# Altium schematic sheet WIFI控制平台.SchDoc
size A4
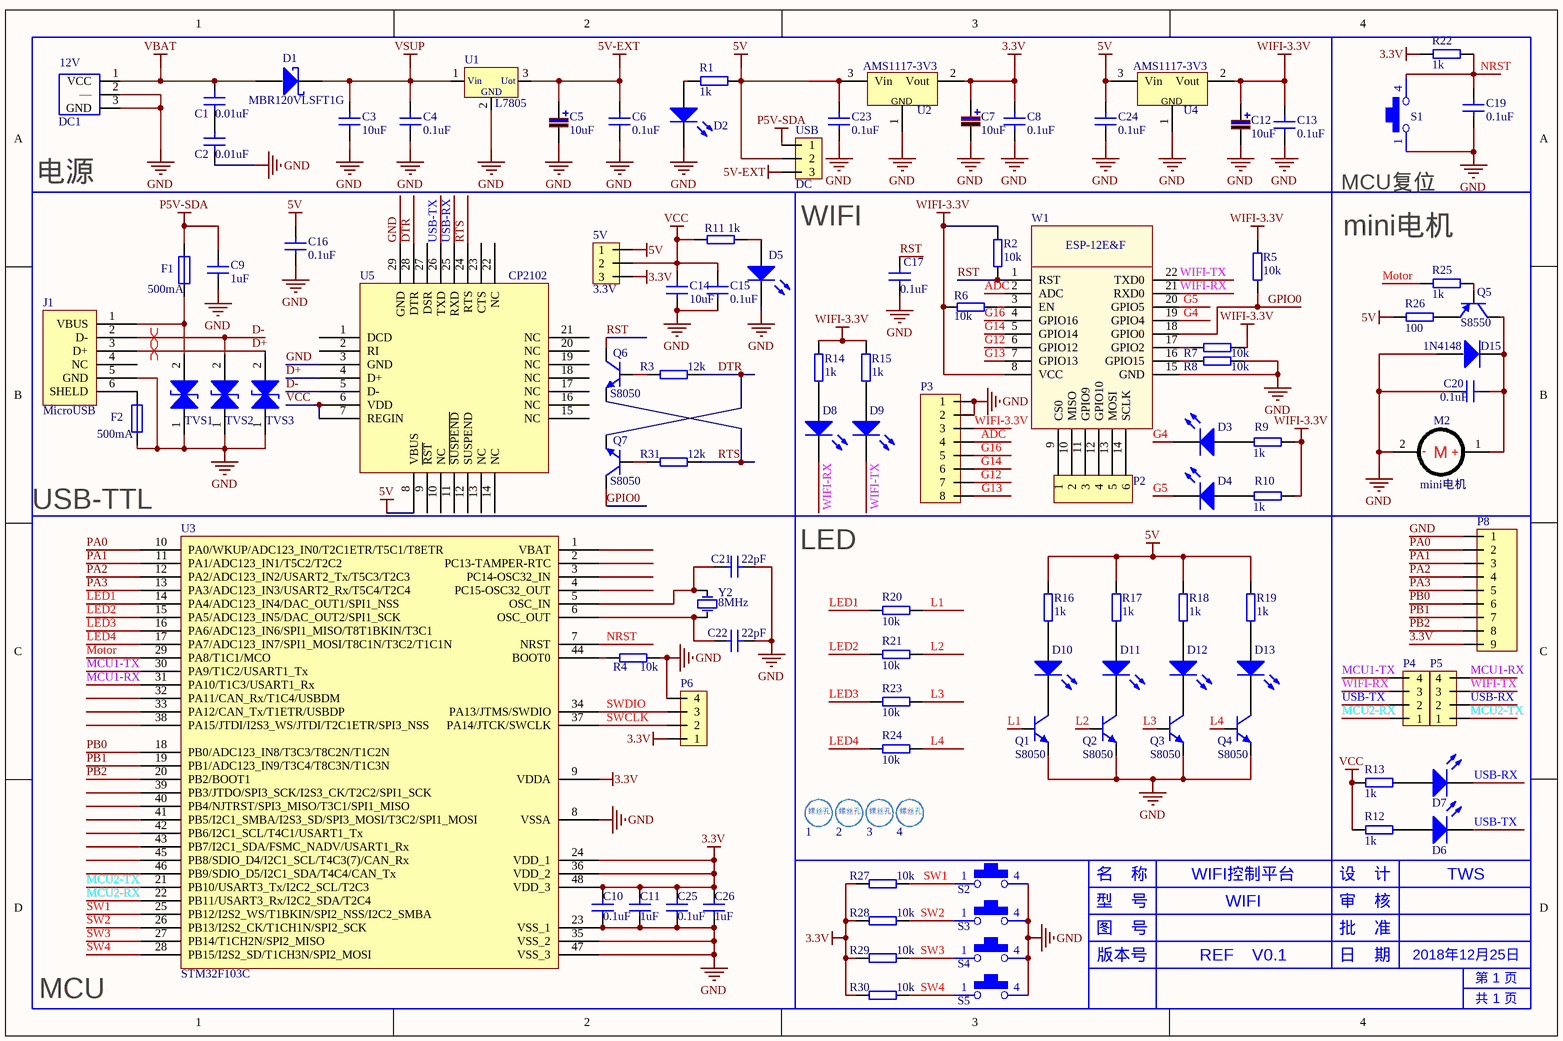
[diagram p0: WIFI控制平台.SchDoc]

## Parts
1  螺丝孔  [3.2mm螺丝孔]  (value not drawn)
2  螺丝孔  [3.2mm螺丝孔]  (value not drawn)
3  螺丝孔  [3.2mm螺丝孔]  (value not drawn)
4  螺丝孔  [3.2mm螺丝孔]  (value not drawn)
5V  3.3V  [HDR2.54-1X3]
C1  0.01uF  [C0805]
C2  0.01uF  [C0805]
C3  10uF  [C1210]
C4  0.1uF  [C0805]
C5  10uF  [C1206-p]
C6  0.1uF  [C0805]
C7  10uF  [C1206-p]
C8  0.1uF  [C0805]
C9  1uF  [C0603]
C10  0.1uF  [C0603]
C11  1uF  [C0603]
C12  10uF  [C1206-p]
C13  0.1uF  [C0805]
C14  10uF  [C0805]
C15  0.1uF  [C0603]
C16  0.1uF  [C0603]
C17  0.1uF  [C0603]
C19  0.1uF  [C0603]
C20  0.1uF  [C0805]
C21  22pF  [C0603]
C22  22pF  [C0603]
C23  0.1uF  [C0805]
C24  0.1uF  [C0805]
C25  0.1uF  [C0603]
C26  1uF  [C0603]
D1  MBR120VLSFT1G  [D-SMA]
D2  LED 红  [L0805]  (value not drawn)
D3  LED 红  [L0805]  (value not drawn)
D4  LED 红  [L0805]  (value not drawn)
D5  LED 红  [L0805]  (value not drawn)
D6  LED 红  [L0805]  (value not drawn)
D7  LED 红  [L0805]  (value not drawn)
D8  LED 红  [L0805]  (value not drawn)
D9  LED 红  [L0805]  (value not drawn)
D10  3528  [LED_3528]  (value not drawn)
D11  3528  [LED_3528]  (value not drawn)
D12  3528  [LED_3528]  (value not drawn)
D13  3528  [LED_3528]  (value not drawn)
D15  1N4148  [D0805]
DC1  12V  [DC-1]
F1  500mA  [R0805]
F2  500mA  [R0805]
J1  MicroUSB  [USB-Micro-牛角]
M2  mini电机  [mini电机]
P2  Header_1x6  [HDR2.54-1X6]  (value not drawn)
P3  Header_1x8  [HDR2.54-1X8]  (value not drawn)
P4  Header4  [HDR2.54-1X4]  (value not drawn)
P5  Header4  [HDR2.54-1X4]  (value not drawn)
P6  Header4  [HDR2.54-1X4-RowSeat]  (value not drawn)
P8  Header_1x9  [HDR2.54-1X9]  (value not drawn)
Q1  S8050  [SOT-23]
Q2  S8050  [SOT-23]
Q3  S8050  [SOT-23]
Q4  S8050  [SOT-23]
Q5  S8550  [SOT-23]
Q6  S8050  [SOT-23]
Q7  S8050  [SOT-23]
R1  1k  [R0603]
R2  10k  [R0603]
R3  12k  [R0603]
R4  10k  [R0603]
R5  10k  [R0603]
R6  10k  [R0603]
R7  10k  [R0603]
R8  10k  [R0603]
R9  1k  [R0603]
R10  1k  [R0603]
R11  1k  [R0603]
R12  1k  [R0603]
R13  1k  [R0603]
R14  1k  [R0603]
R15  1k  [R0603]
R16  1k  [R0805]
R17  1k  [R0805]
R18  1k  [R0805]
R19  1k  [R0805]
R20  10k  [R0603]
R21  10k  [R0603]
R22  1k  [R0603]
R23  10k  [R0603]
R24  10k  [R0603]
R25  1k  [R0603]
R26  100  [R0805]
R27  10k  [R0603]
R28  10k  [R0603]
R29  10k  [R0603]
R30  10k  [R0603]
R31  12k  [R0603]
S1  BUTTON  [Button-SW-SMD1]  (value not drawn)
S2  BUTTON  [Button-SW-SMD1]  (value not drawn)
S3  BUTTON  [Button-SW-SMD1]  (value not drawn)
S4  BUTTON  [Button-SW-SMD1]  (value not drawn)
S5  BUTTON  [Button-SW-SMD1]  (value not drawn)
TVS1  PESD5V0S1BA  [D-SOD-323]  (value not drawn)
TVS2  PESD5V0S1BA  [D-SOD-323]  (value not drawn)
TVS3  PESD5V0S1BA  [D-SOD-323]  (value not drawn)
U1  L7805  [TO252-3]
U2  AMS1117-3V3  [SOT-233]
U3  STM32F103C  [LQFP7x7-48]
U4  AMS1117-3V3  [SOT-233]
U5  CP2102  [QFN28]
USB  DC  [HDR2.54-1X3]
W1  ESP-12E&F  [ESP-12E&F Module]
Y2  value 8MHz  [X-SM49]  (hidden comment: XTAL)

## Nets
3.3V: 5V.3 C7.1 C8.2 C10.2 C11.2 C25.2 C26.2 P6.1 P8.9 R22.2 R27.1 R28.1 R29.1 R30.1 U2.2(Vout) U3.9(VDDA) U3.24(VDD_1) U3.36(VDD_2) U3.48(VDD_3)
5V: 5V.1 C16.2 C23.2 C24.2 R1.1 R16.2 R17.2 R18.2 R19.2 R26.1 U2.3(Vin) U4.3(Vin) U5.8(VBUS) USB.2
5V-EXT: C5.1 C6.2 U1.3 USB.3
GND: C2.1 C3.1 C4.1 C5.2 C6.1 C7.2 C8.1 C9.1 C10.1 C11.1 C12.2 C13.1 C14.1 C15.1 C16.1 C17.1 C19.1 C20.1 C21.2 C22.2 C23.1 C24.1 C25.1 C26.1 D2.2(K) D5.2(K) D15.1(A) DC1.2(—) DC1.3(GND) F2.2 J1.5(GND) M2.2(M-) P3.1 P3.2 P6.4 P8.1 Q1.2(E) Q2.2(E) Q3.2(E) Q4.2(E) R4.2 R8.2 S1.1 S2.4 S3.4 S4.4 S5.4 TVS1.1(A) TVS2.1(A) TVS3.1(A) U1.2 U2.1(GND) U3.8(VSSA) U3.23(VSS_1) U3.35(VSS_2) U3.47(VSS_3) U4.1(GND) U5.3(GND) U5.29(GND) W1.15(GND)
P5V-SDA: C9.2 F1.1 USB.1
VBAT: C1.2 D1.1(A) DC1.1(VCC)
VCC: 5V.2 C14.2 C15.2 R11.1 R12.2 R13.2 U5.6(VDD) U5.7(REGIN)
VSUP: C3.2 C4.2 D1.2(K) U1.1
WIFI-3.3V: C12.1 C13.2 P3.3 R2.2 R5.2 R6.1 R7.2 R9.1 R10.1 R14.2 R15.2 U4.2(Vout) W1.8(VCC)
ADC: P3.4 W1.2(ADC)
D+: J1.3(D+) TVS3.2 U5.4(D+)
D-: J1.2(D-) TVS2.2 U5.5(D-)
DTR: Q7.2(E) R3.2 U5.28(DTR)
G4: D3.2(K) W1.19(GPIO4)
G5: D4.2(K) W1.20(GPIO5)
G12: P3.7 W1.6(GPIO12)
G13: P3.8 W1.7(GPIO13)
G14: P3.6 W1.5(GPIO14)
G16: P3.5 W1.4(GPIO16)
GPIO0: Q7.3(C) R5.1 W1.18(GPIO0)
L1: Q1.1(B) R20.2
L2: Q2.1(B) R21.2
L3: Q3.1(B) R23.2
L4: Q4.1(B) R24.2
LED1: R20.1 U3.14(PA4/ADC123_IN4/DAC_OUT1/SPI1_NSS)
LED2: R21.1 U3.15(PA5/ADC123_IN5/DAC_OUT2/SPI1_SCK)
LED3: R23.1 U3.16(PA6/ADC123_IN6/SPI1_MISO/T8T1BKIN/T3C1)
LED4: R24.1 U3.17(PA7/ADC123_IN7/SPI1_MOSI/T8C1N/T3C2/T1C1N)
MCU1-RX: P5.4 U3.31(PA10/T1C3/USART1_Rx)
MCU1-TX: P4.4 U3.30(PA9/T1C2/USART1_Tx)
MCU2-RX: P4.1 U3.22(PB11/USART3_Rx/I2C2_SDA/T2C4)
MCU2-TX: P5.1 U3.21(PB10/USART3_Tx/I2C2_SCL/T2C3)
Motor: R25.2 U3.29(PA8/T1C1/MCO)
NRST: C19.2 R22.1 S1.4 U3.7(NRST)
PA0: P8.2 U3.10(PA0/WKUP/ADC123_IN0/T2C1ETR/T5C1/T8ETR)
PA1: P8.3 U3.11(PA1/ADC123_IN1/T5C2/T2C2)
PA2: P8.4 U3.12(PA2/ADC123_IN2/USART2_Tx/T5C3/T2C3)
PA3: P8.5 U3.13(PA3/ADC123_IN3/USART2_Rx/T5C4/T2C4)
PB0: P8.6 U3.18(PB0/ADC123_IN8/T3C3/T8C2N/T1C2N)
PB1: P8.7 U3.19(PB1/ADC123_IN9/T3C4/T8C3N/T1C3N)
PB2: P8.8 U3.20(PB2/BOOT1)
RST: C17.2 Q6.3(C) R2.1 W1.1(RST)
RTS: Q6.2(E) R31.2 U5.24(RTS)
SW1: R27.2 S2.1 U3.25(PB12/I2S2_WS/T1BKIN/SPI2_NSS/I2C2_SMBA)
SW2: R28.2 S3.1 U3.26(PB13/I2S2_CK/T1CH1N/SPI2_SCK)
SW3: R29.2 S4.1 U3.27(PB14/T1CH2N/SPI2_MISO)
SW4: R30.2 S5.1 U3.28(PB15/I2S2_SD/T1CH3N/SPI2_MOSI)
SWCLK: P6.2 U3.37(PA14/JTCK/SWCLK)
SWDIO: P6.3 U3.34(PA13/JTMS/SWDIO)
USB-RX: D7.2(K) P5.2 U5.25(RXD)
USB-TX: D6.2(K) P4.2 U5.26(TXD)
WIFI-RX: D8.2(K) P4.3 W1.21(RXD0)
WIFI-TX: D9.2(K) P5.3 W1.22(TXD0)
NetC1_1: C1.1 C2.2
NetC20_2: C20.2 D15.2(K) M2.1(M+) Q5.3(C)
NetC21_1: C21.1 U3.5(OSC_IN) Y2.2(OSC2)
NetC22_1: C22.1 U3.6(OSC_OUT) Y2.1(OSC1)
NetD2_1: D2.1(A) R1.2
NetD3_1: D3.1(A) R9.2
NetD4_1: D4.1(A) R10.2
NetD5_1: D5.1(A) R11.2
NetD6_1: D6.1(A) R12.1
NetD7_1: D7.1(A) R13.1
NetD8_1: D8.1(A) R14.1
NetD9_1: D9.1(A) R15.1
NetD10_1: D10.1(A) R16.1
NetD10_2: D10.2(K) Q1.3(C)
NetD11_1: D11.1(A) R17.1
NetD11_2: D11.2(K) Q2.3(C)
NetD12_1: D12.1(A) R18.1
NetD12_2: D12.2(K) Q3.3(C)
NetD13_1: D13.1(A) R19.1
NetD13_2: D13.2(K) Q4.3(C)
NetF1_2: F1.2 J1.1(VBUS) TVS1.2
NetF2_1: F2.1 J1.6(SHELD)
NetP2_1: P2.1 W1.9(CS0)
NetP2_2: P2.2 W1.10(MISO)
NetP2_3: P2.3 W1.11(GPIO9)
NetP2_4: P2.4 W1.12(GPIO10)
NetP2_5: P2.5 W1.13(MOSI)
NetP2_6: P2.6 W1.14(SCLK)
NetQ5_1: Q5.1(B) R25.1
NetQ5_2: Q5.2(E) R26.2
NetQ6_1: Q6.1(B) R3.1
NetQ7_1: Q7.1(B) R31.1
NetR4_1: R4.1 U3.44(BOOT0)
NetR6_2: R6.2 W1.3(EN)
NetR7_1: R7.1 W1.17(GPIO2)
NetR8_1: R8.1 W1.16(GPIO15)

Not connected (* = marked no-connect by the designer): J1 4(NC); U3 1(VBAT) 2(PC13-TAMPER-RTC) 3(PC14-OSC32_IN) 4(PC15-OSC32_OUT) 32(PA11/CAN_Rx/T1C4/USBDM) 33(PA12/CAN_Tx/T1ETR/USBDP) 38(PA15/JTDI/I2S3_WS/JTDI/T2C1ETR/SPI3_NSS) 39(PB3/JTDO/SPI3_SCK/I2S3_CK/T2C2/SPI1_SCK) 40(PB4/NJTRST/SPI3_MISO/T3C1/SPI1_MISO) 41(PB5/I2C1_SMBA/I2S3_SD/SPI3_MOSI/T3C2/SPI1_MOSI) 42(PB6/I2C1_SCL/T4C1/USART1_Tx) 43(PB7/I2C1_SDA/FSMC_NADV/USART1_Rx) 45(PB8/SDIO_D4/I2C1_SCL/T4C3(7)/CAN_Rx) 46(PB9/SDIO_D5/I2C1_SDA/T4C4/CAN_Tx); U5 1(DCD) 2(RI) 9(~{RST}) 10(NC) 11(~{SUSPEND}) 12(SUSPEND) 13(NC) 14(NC) 15(NC) 16(NC) 17(NC) 18(NC) 19(NC) 20(NC) 21(NC) 22(NC) 23(CTS) 27(DSR)

## Layout directives
differential pair: D+, D-

## Notes on the sheet
- (near DC1) 电源
- (near S1) MCU复位
- (near USB) WIFI
- mini电机
- USB-TTL
- LED
- 名    称
- 图    号
- 型    号
- WIFI
- WIFI控制平台
- 设    计
- 审    核
- 批    准
- (near D6) TWS
- MCU
- 版本号
- REF    V0.1
- 日    期
- 2018年12月25日
- 第 1 页
- 共 1 页
- (in symbol 78**) Vin; Uot; GND
- (in symbol 电机0_1) -; M; +

## Library data of the parts
5V USB = Header3
  5V: value: Header3
  USB: value: DC
C1-C4 C6 C8-C11 C13-C17 C19-C26 = cap-2
  C1 C2: value: 0.01uF
  C3 C14: value: 10uF
  C4 C6 C8 C10 C13 C15-C17 C19 C20 C23-C25: value: 0.1uF
  C9 C11 C26: value: 1uF
  C21 C22: value: 22pF
C5 C7 C12 = cap: value: 1uF/16V
D1 = Diode_1: value: MBR120VLSFT1G
D2-D9 = LED: value: LED 红
D10-D13 = LED_3528: value: 3528
D15 = Diode: value: 1N4148
DC1 = DC插座
F1 F2 = Fuse: value: 500mA
J1 = USB-Micro: MicroUSB 牛角接口; value: MicroUSB
M2 = 电机0_1
P2 = Header6: value: Header_1x6
P3 = Header8: value: Header_1x8
P8 = Header9: value: Header_1x9
Q1-Q4 Q6 Q7 = NPN: value: S8050
Q5 = PNP-8050: value: S8550
R1 R2 R4-R30 = RES
  R1 R9-R19 R22 R25: value: 1k
  R2 R4-R8 R20 R21 R23 R24 R27-R30: value: 10k
  R26: value: 100
R3 R31 = SMT_R_0402: Surface mount resistor 0402
S1-S5 = BUTTON1
TVS1-TVS3 = DIODE-TVS: CA-双向; value: PESD5V0S1BA
U1 = 78**
U2 U4 = AMS1117: value: AMS1117-3V3
U3 = STM32F103C: STM32单片机48引脚
W1 = ESP-12E&F: ESP-12E&F Module
Y2 = XTAL: 晶振; Published: 8-Jun-2000; LatestRevisionDate: 17-Jul-2002; LatestRevisionNote: Re-released for DXP Platform.; PackageReference: R38; Publisher: Altium Limited